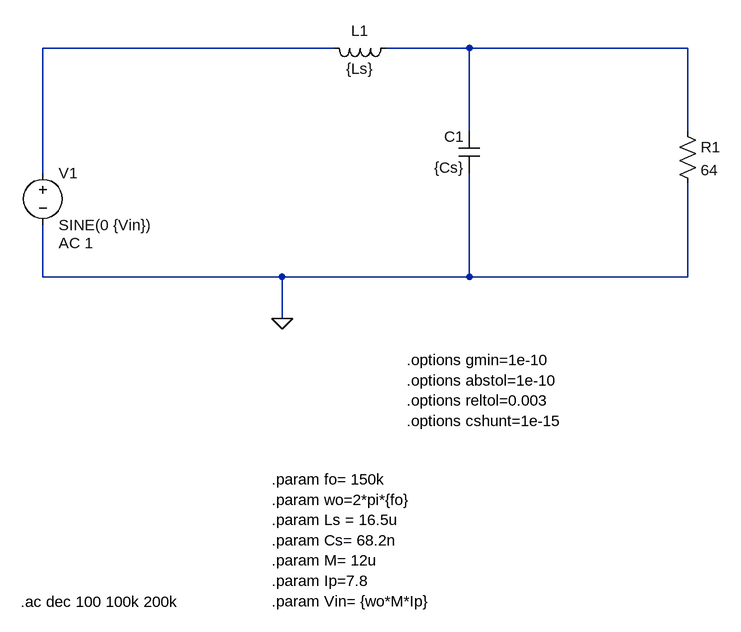
[diagram p0: schematic paralel-compensation-parellel-AC.asc]
paralel-compensation-parellel-AC.asc, the LTspice schematic file:
Version 4
SHEET 1 2752 1872
WIRE 1184 -64 736 -64
WIRE 1392 -64 1264 -64
WIRE 1728 -64 1392 -64
WIRE 1392 64 1392 -64
WIRE 1728 64 1728 -64
WIRE 736 128 736 -64
WIRE 736 288 736 208
WIRE 1104 288 736 288
WIRE 1392 288 1392 128
WIRE 1392 288 1104 288
WIRE 1728 288 1728 144
WIRE 1728 288 1392 288
WIRE 1104 352 1104 288
FLAG 1104 352 0
SYMBOL voltage 736 112 R0
WINDOW 123 24 124 Left 2
WINDOW 39 0 0 Left 0
SYMATTR Value2 AC 1
SYMATTR InstName V1
SYMATTR Value SINE(0 {Vin})
SYMBOL ind 1280 -80 R90
WINDOW 0 5 56 VBottom 2
WINDOW 3 32 56 VTop 2
SYMATTR InstName L1
SYMATTR Value {Ls}
SYMBOL cap 1408 128 R180
WINDOW 0 24 56 Left 2
WINDOW 3 24 8 Left 2
SYMATTR InstName C1
SYMATTR Value {Cs}
SYMBOL res 1712 48 R0
SYMATTR InstName R1
SYMATTR Value 64
TEXT 1088 600 Left 2 !.param fo= 150k\n.param wo=2*pi*{fo}\n.param Ls = 16.5u\n.param Cs= 68.2n\n.param M= 12u\n.param Ip=7.8\n.param Vin= {wo*M*Ip}
TEXT 1296 416 Left 2 !.options gmin=1e-10\n.options abstol=1e-10\n.options reltol=0.003\n.options cshunt=1e-15
TEXT 702 788 Left 2 !.ac dec 100 100k 200k

The netlist it stands for:
* paralel-compensation-parellel-AC.asc
V1 N001 0 SINE(0 {Vin}) AC 1
L1 N002 N001 {Ls}
C1 0 N002 {Cs}
R1 N002 0 64
.param fo= 150k
.param wo=2*pi*{fo}
.param Ls = 16.5u
.param Cs= 68.2n
.param M= 12u
.param Ip=7.8
.param Vin= {wo*M*Ip}
.options gmin=1e-10
.options abstol=1e-10
.options reltol=0.003
.options cshunt=1e-15
.ac dec 100 100k 200k
.backanno
.end